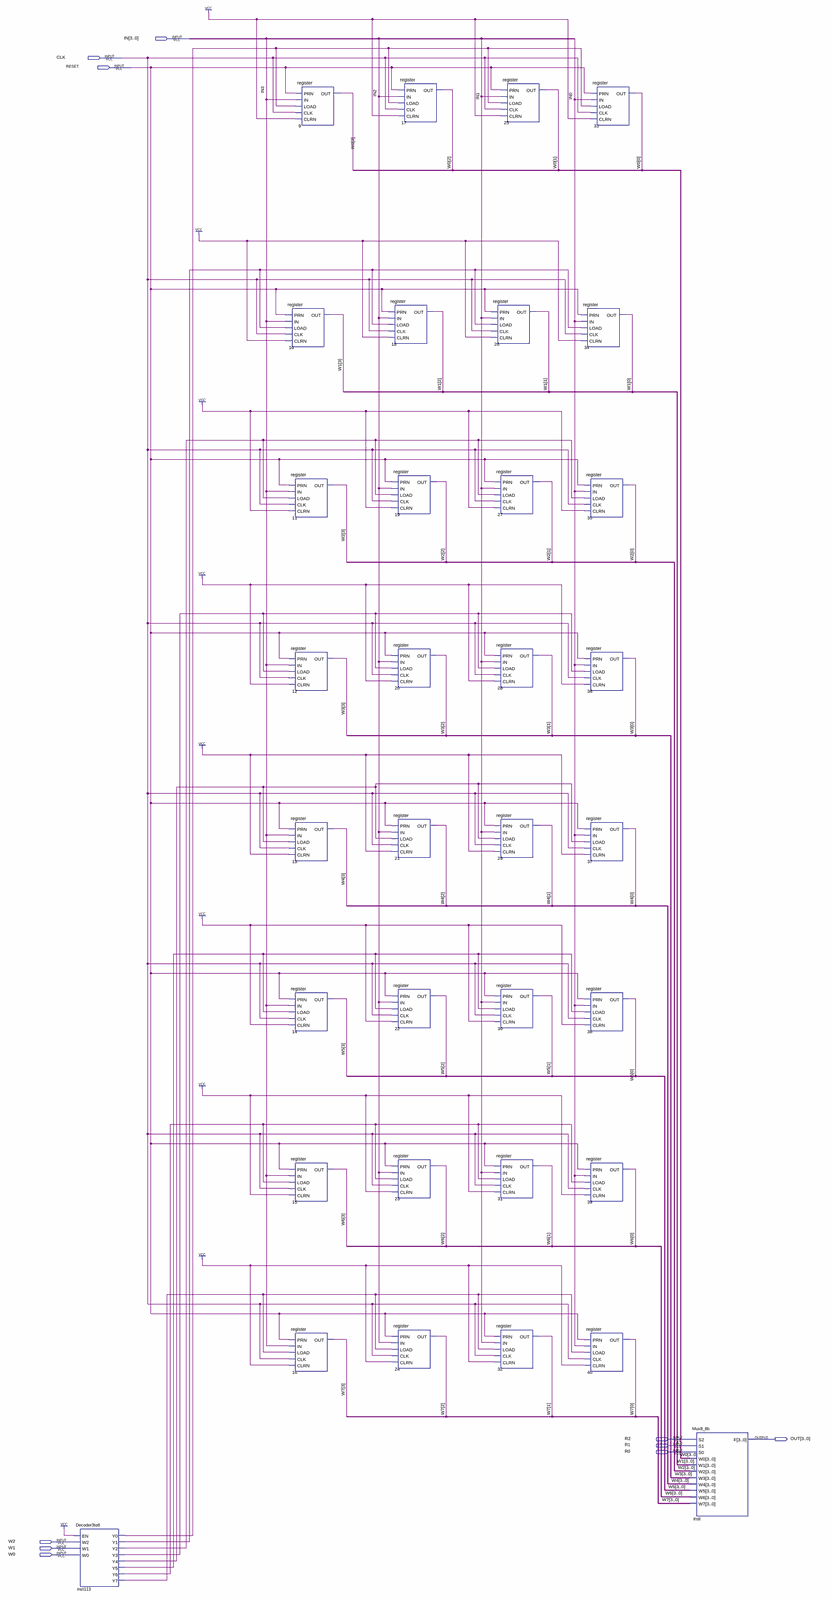
[diagram p0: schematic sheet, whole]
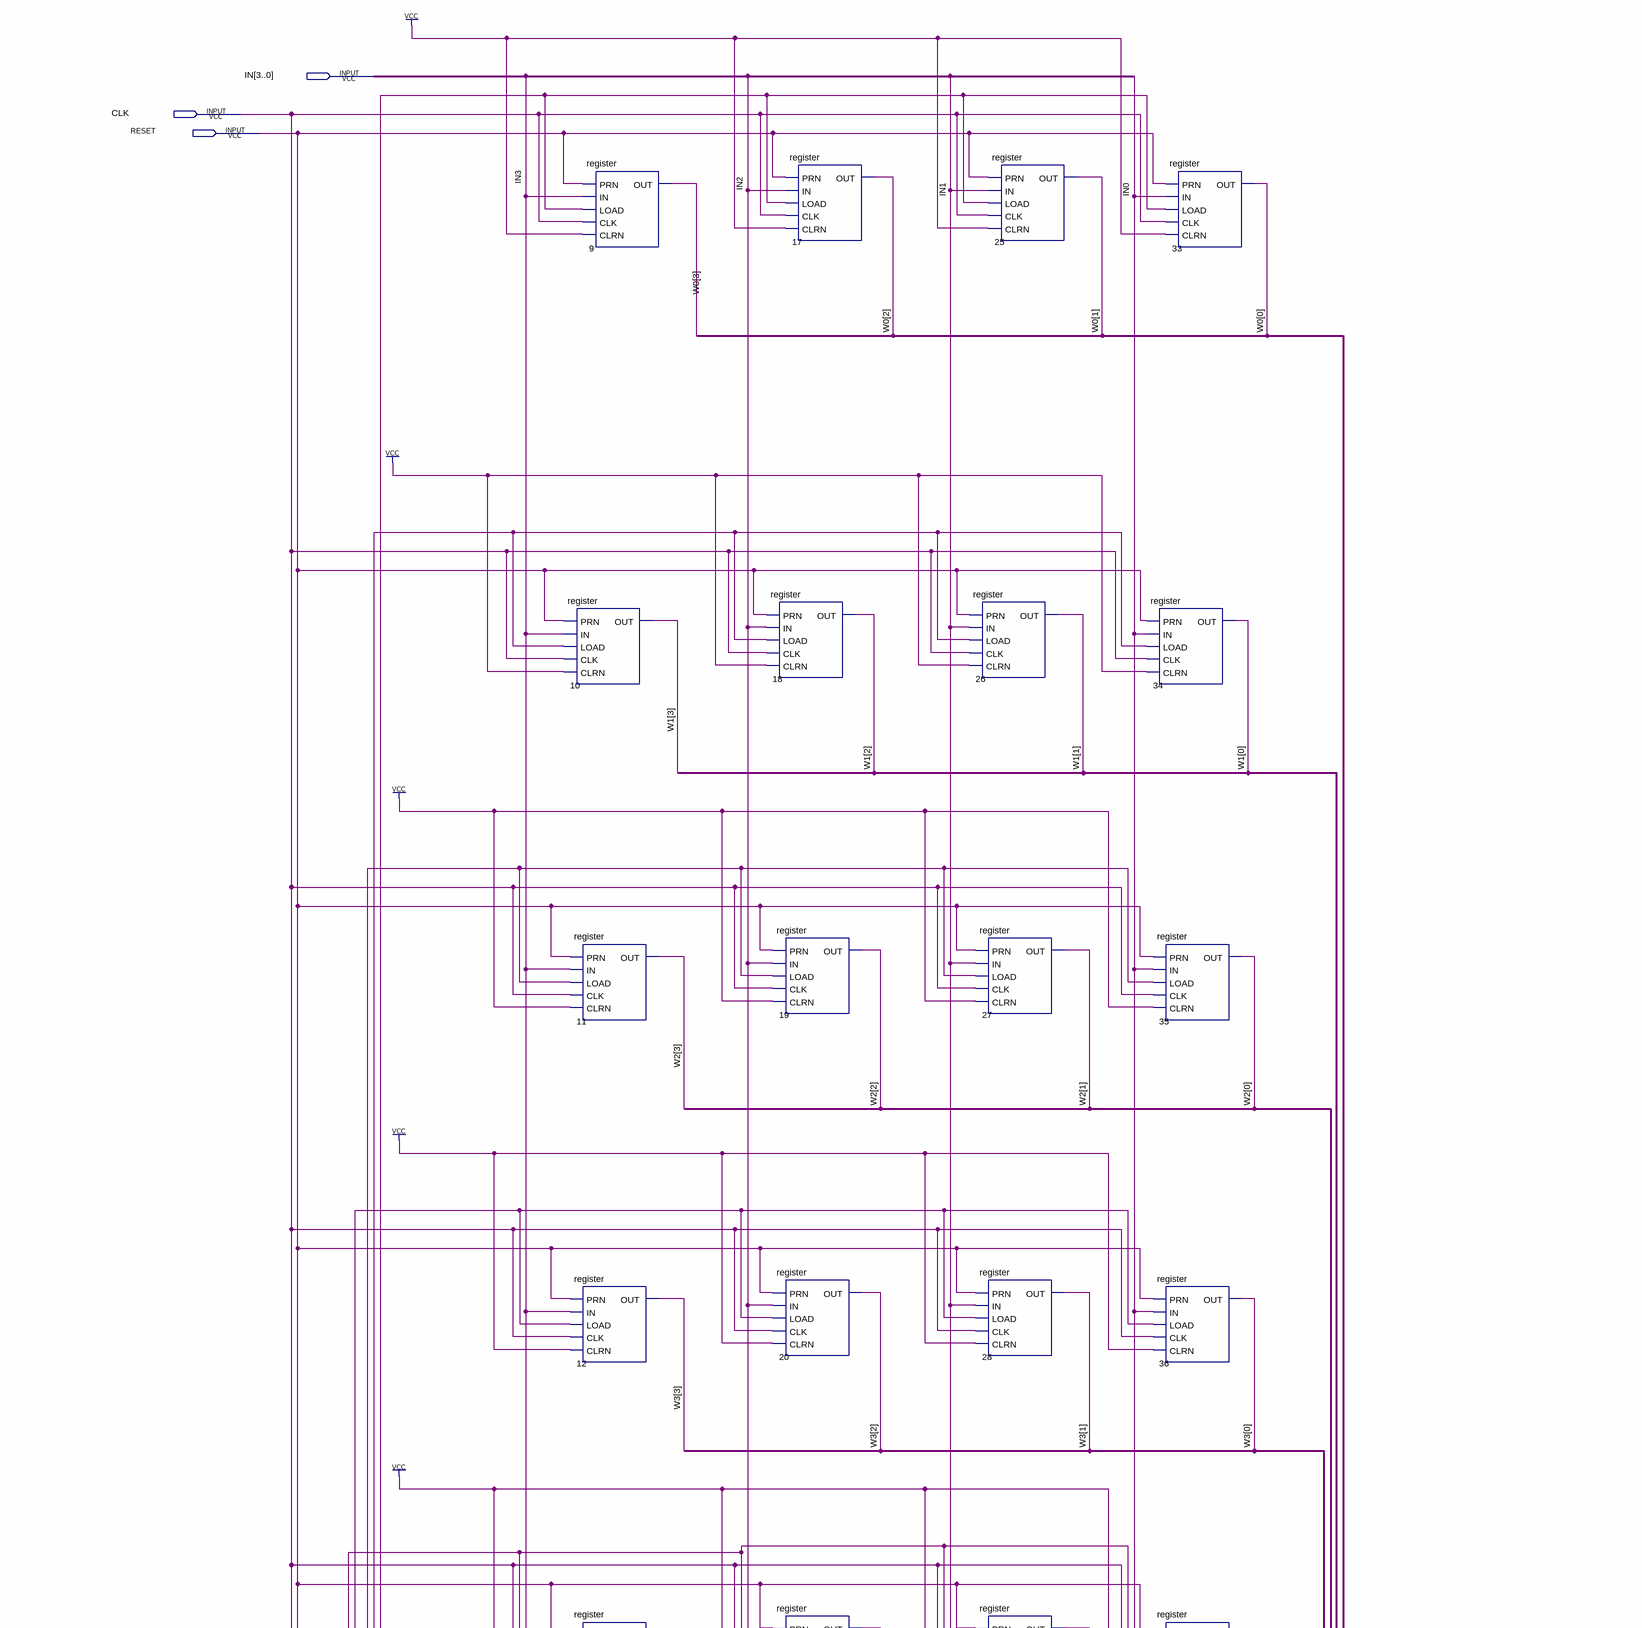
[diagram p1: schematic sheet, upper part]
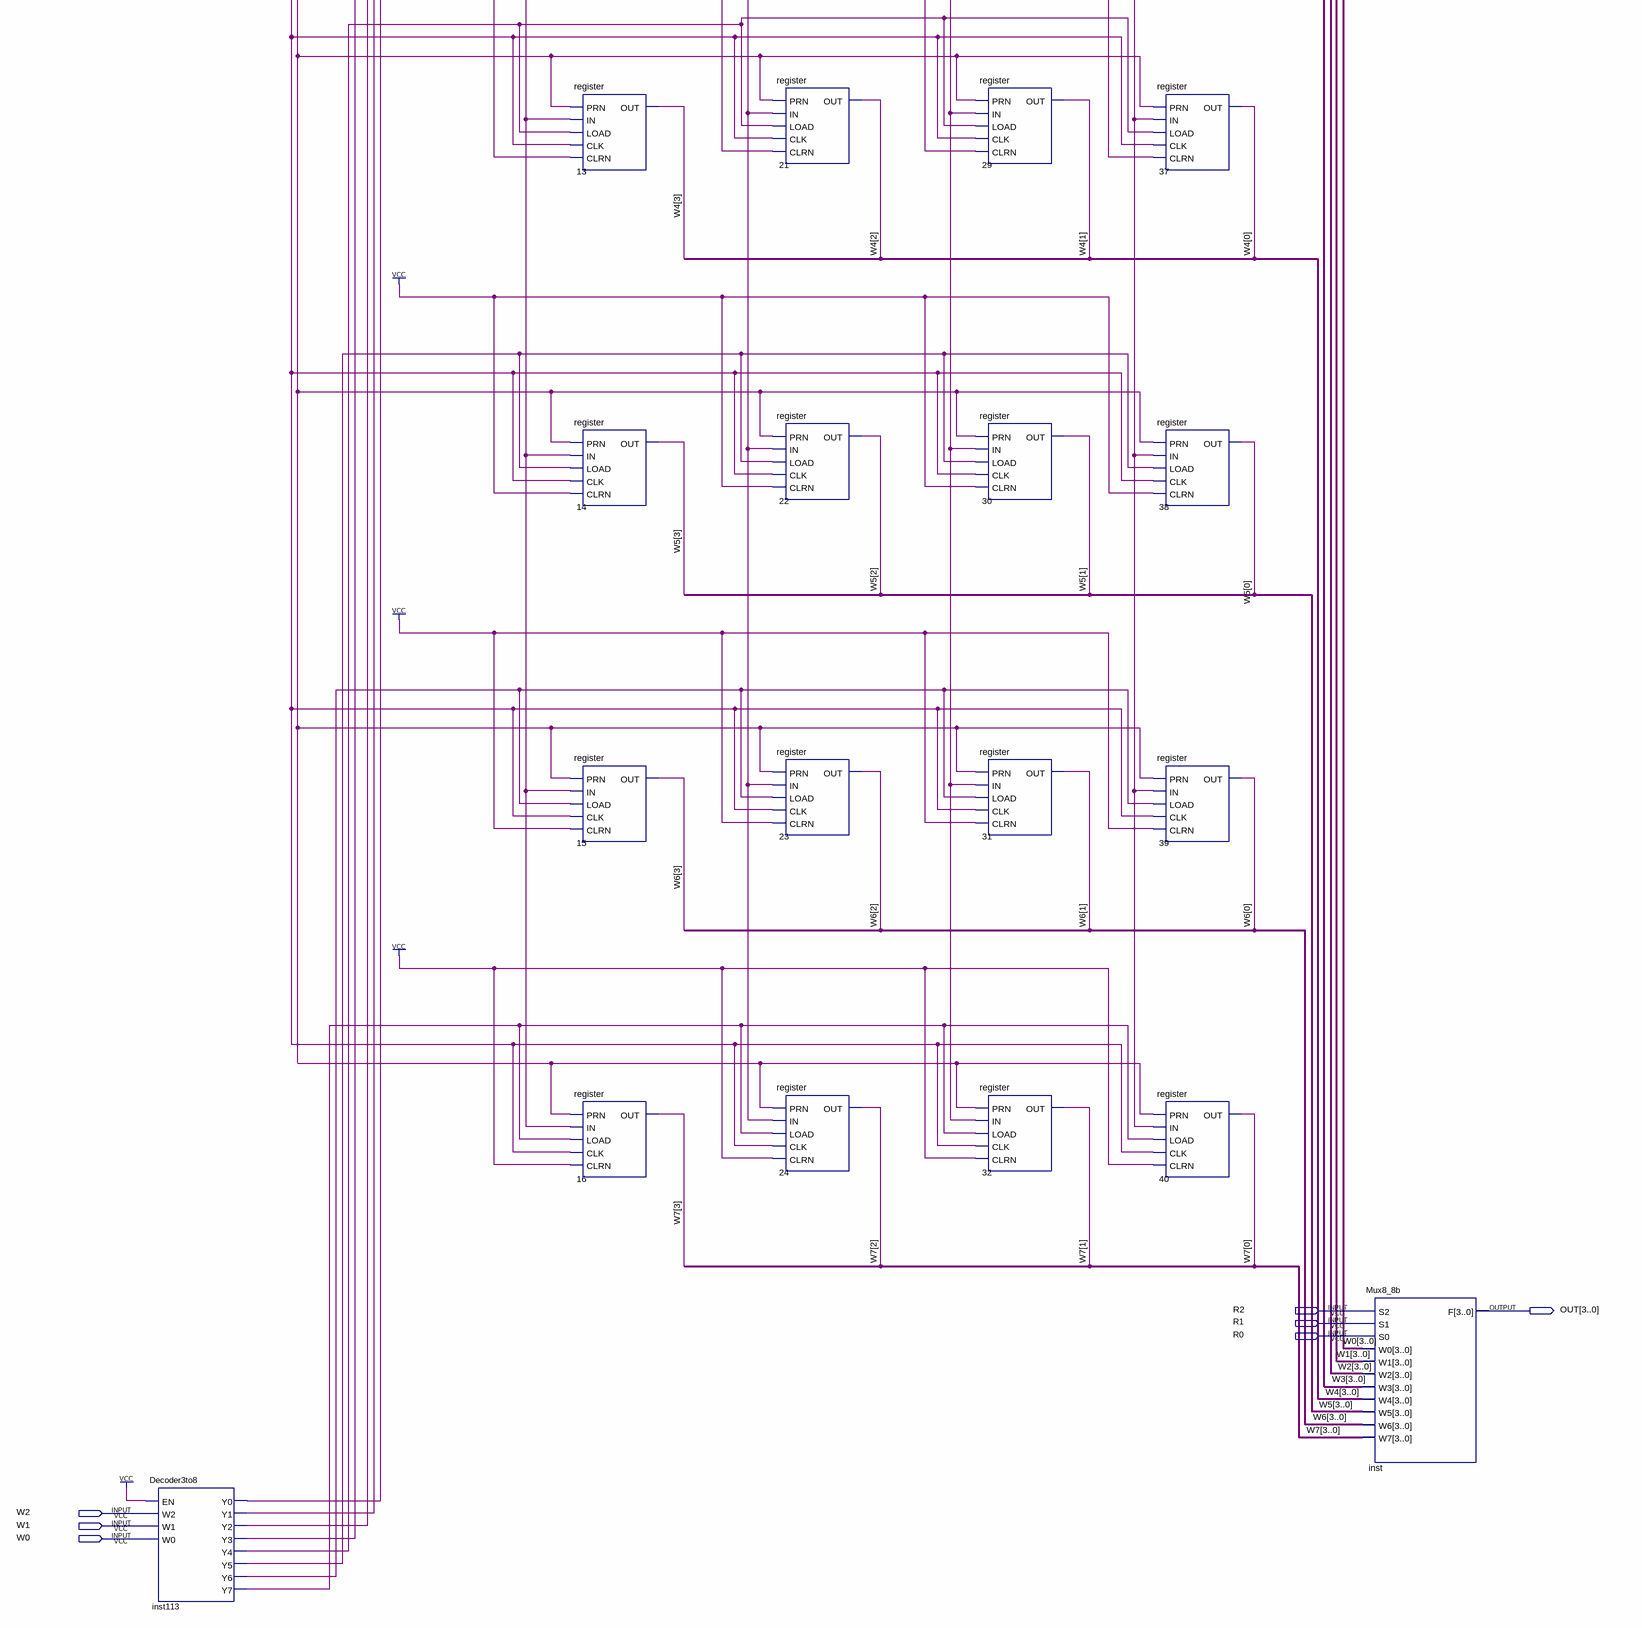
[diagram p2: schematic sheet, lower part]
// Quartus schematic itemcount.bdf as structural Verilog: 34 symbols, 10 pins
module itemcount (
  input  [3:0] IN,
  input  CLK,
  input  RESET,
  input  R2,
  input  R1,
  input  R0,
  input  W2,
  input  W1,
  input  W0,
  output [3:0] OUT
);

  wire inst113_y0, inst113_y1, inst113_y2, inst113_y3, inst113_y4, inst113_y5, inst113_y6, inst113_y7;
  wire [3:0] W0_bus, W1_bus, W2_bus, W3, W4, W5, W6, W7;

  Decoder3to8 inst113 (
    .EN(1'b1), .W2(W2), .W1(W1), .W0(W0), .Y0(inst113_y0), .Y1(inst113_y1), .Y2(inst113_y2), .Y3(inst113_y3),
    .Y4(inst113_y4), .Y5(inst113_y5), .Y6(inst113_y6), .Y7(inst113_y7));
  register u_9 (.PRN(RESET), .IN(IN[3]), .LOAD(inst113_y0), .CLK(CLK), .CLRN(1'b1), .OUT(W0_bus[3]));
  register u_10 (.PRN(RESET), .IN(IN[3]), .LOAD(inst113_y1), .CLK(CLK), .CLRN(1'b1), .OUT(W1_bus[3]));
  register u_11 (.PRN(RESET), .IN(IN[3]), .LOAD(inst113_y2), .CLK(CLK), .CLRN(1'b1), .OUT(W2_bus[3]));
  register u_12 (.PRN(RESET), .IN(IN[3]), .LOAD(inst113_y3), .CLK(CLK), .CLRN(1'b1), .OUT(W3[3]));
  register u_13 (.PRN(RESET), .IN(IN[3]), .LOAD(inst113_y4), .CLK(CLK), .CLRN(1'b1), .OUT(W4[3]));
  register u_14 (.PRN(RESET), .IN(IN[3]), .LOAD(inst113_y5), .CLK(CLK), .CLRN(1'b1), .OUT(W5[3]));
  register u_15 (.PRN(RESET), .IN(IN[3]), .LOAD(inst113_y6), .CLK(CLK), .CLRN(1'b1), .OUT(W6[3]));
  register u_16 (.PRN(RESET), .IN(IN[3]), .LOAD(inst113_y7), .CLK(CLK), .CLRN(1'b1), .OUT(W7[3]));
  register u_17 (.PRN(RESET), .IN(IN[2]), .LOAD(inst113_y0), .CLK(CLK), .CLRN(1'b1), .OUT(W0_bus[2]));
  register u_18 (.PRN(RESET), .IN(IN[2]), .LOAD(inst113_y1), .CLK(CLK), .CLRN(1'b1), .OUT(W1_bus[2]));
  register u_19 (.PRN(RESET), .IN(IN[2]), .LOAD(inst113_y2), .CLK(CLK), .CLRN(1'b1), .OUT(W2_bus[2]));
  register u_20 (.PRN(RESET), .IN(IN[2]), .LOAD(inst113_y3), .CLK(CLK), .CLRN(1'b1), .OUT(W3[2]));
  register u_21 (.PRN(RESET), .IN(IN[2]), .LOAD(inst113_y4), .CLK(CLK), .CLRN(1'b1), .OUT(W4[2]));
  register u_22 (.PRN(RESET), .IN(IN[2]), .LOAD(inst113_y5), .CLK(CLK), .CLRN(1'b1), .OUT(W5[2]));
  register u_23 (.PRN(RESET), .IN(IN[2]), .LOAD(inst113_y6), .CLK(CLK), .CLRN(1'b1), .OUT(W6[2]));
  register u_24 (.PRN(RESET), .IN(IN[2]), .LOAD(inst113_y7), .CLK(CLK), .CLRN(1'b1), .OUT(W7[2]));
  register u_25 (.PRN(RESET), .IN(IN[1]), .LOAD(inst113_y0), .CLK(CLK), .CLRN(1'b1), .OUT(W0_bus[1]));
  register u_26 (.PRN(RESET), .IN(IN[1]), .LOAD(inst113_y1), .CLK(CLK), .CLRN(1'b1), .OUT(W1_bus[1]));
  register u_27 (.PRN(RESET), .IN(IN[1]), .LOAD(inst113_y2), .CLK(CLK), .CLRN(1'b1), .OUT(W2_bus[1]));
  register u_28 (.PRN(RESET), .IN(IN[1]), .LOAD(inst113_y3), .CLK(CLK), .CLRN(1'b1), .OUT(W3[1]));
  register u_29 (.PRN(RESET), .IN(IN[1]), .LOAD(inst113_y4), .CLK(CLK), .CLRN(1'b1), .OUT(W4[1]));
  register u_30 (.PRN(RESET), .IN(IN[1]), .LOAD(inst113_y5), .CLK(CLK), .CLRN(1'b1), .OUT(W5[1]));
  register u_31 (.PRN(RESET), .IN(IN[1]), .LOAD(inst113_y6), .CLK(CLK), .CLRN(1'b1), .OUT(W6[1]));
  register u_32 (.PRN(RESET), .IN(IN[1]), .LOAD(inst113_y7), .CLK(CLK), .CLRN(1'b1), .OUT(W7[1]));
  register u_33 (.PRN(RESET), .IN(IN[0]), .LOAD(inst113_y0), .CLK(CLK), .CLRN(1'b1), .OUT(W0_bus[0]));
  register u_34 (.PRN(RESET), .IN(IN[0]), .LOAD(inst113_y1), .CLK(CLK), .CLRN(1'b1), .OUT(W1_bus[0]));
  register u_35 (.PRN(RESET), .IN(IN[0]), .LOAD(inst113_y2), .CLK(CLK), .CLRN(1'b1), .OUT(W2_bus[0]));
  register u_36 (.PRN(RESET), .IN(IN[0]), .LOAD(inst113_y3), .CLK(CLK), .CLRN(1'b1), .OUT(W3[0]));
  register u_37 (.PRN(RESET), .IN(IN[0]), .LOAD(inst113_y4), .CLK(CLK), .CLRN(1'b1), .OUT(W4[0]));
  register u_38 (.PRN(RESET), .IN(IN[0]), .LOAD(inst113_y5), .CLK(CLK), .CLRN(1'b1), .OUT(W5[0]));
  register u_39 (.PRN(RESET), .IN(IN[0]), .LOAD(inst113_y6), .CLK(CLK), .CLRN(1'b1), .OUT(W6[0]));
  register u_40 (.PRN(RESET), .IN(IN[0]), .LOAD(inst113_y7), .CLK(CLK), .CLRN(1'b1), .OUT(W7[0]));
  Mux8_8b inst (
    .S2(R2), .S1(R1), .S0(R0), .W0(W0_bus), .W1(W1_bus), .W2(W2_bus), .W3(W3), .W4(W4), .W5(W5), .W6(W6),
    .W7(W7), .F(OUT));
endmodule
